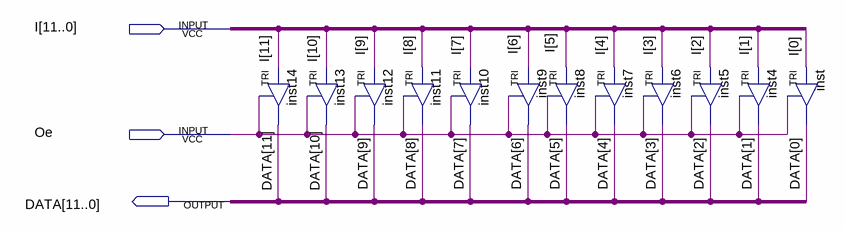
[diagram p0: schematic sheet]
// Quartus schematic Tri12.bdf as structural Verilog: 12 symbols, 3 pins
module Tri12 (
  input  [11:0] I,
  input  Oe,
  output [11:0] DATA
);

  TRI inst14 (.IN(I[11]), .OE(Oe), .OUT(DATA[11]));
  TRI inst13 (.IN(I[10]), .OE(Oe), .OUT(DATA[10]));
  TRI inst11 (.IN(I[8]), .OE(Oe), .OUT(DATA[8]));
  TRI inst12 (.IN(I[9]), .OE(Oe), .OUT(DATA[9]));
  TRI inst10 (.IN(I[7]), .OE(Oe), .OUT(DATA[7]));
  TRI inst8 (.IN(I[5]), .OE(Oe), .OUT(DATA[5]));
  TRI inst9 (.IN(I[6]), .OE(Oe), .OUT(DATA[6]));
  TRI inst6 (.IN(I[3]), .OE(Oe), .OUT(DATA[3]));
  TRI inst7 (.IN(I[4]), .OE(Oe), .OUT(DATA[4]));
  TRI inst5 (.IN(I[2]), .OE(Oe), .OUT(DATA[2]));
  TRI inst (.IN(I[0]), .OE(Oe), .OUT(DATA[0]));
  TRI inst4 (.IN(I[1]), .OE(Oe), .OUT(DATA[1]));
endmodule
